# Altium project SCH-29227.PrjPcb (part 2 of 2)

## Sheet 01.SchDoc
size 386 x 246 mm
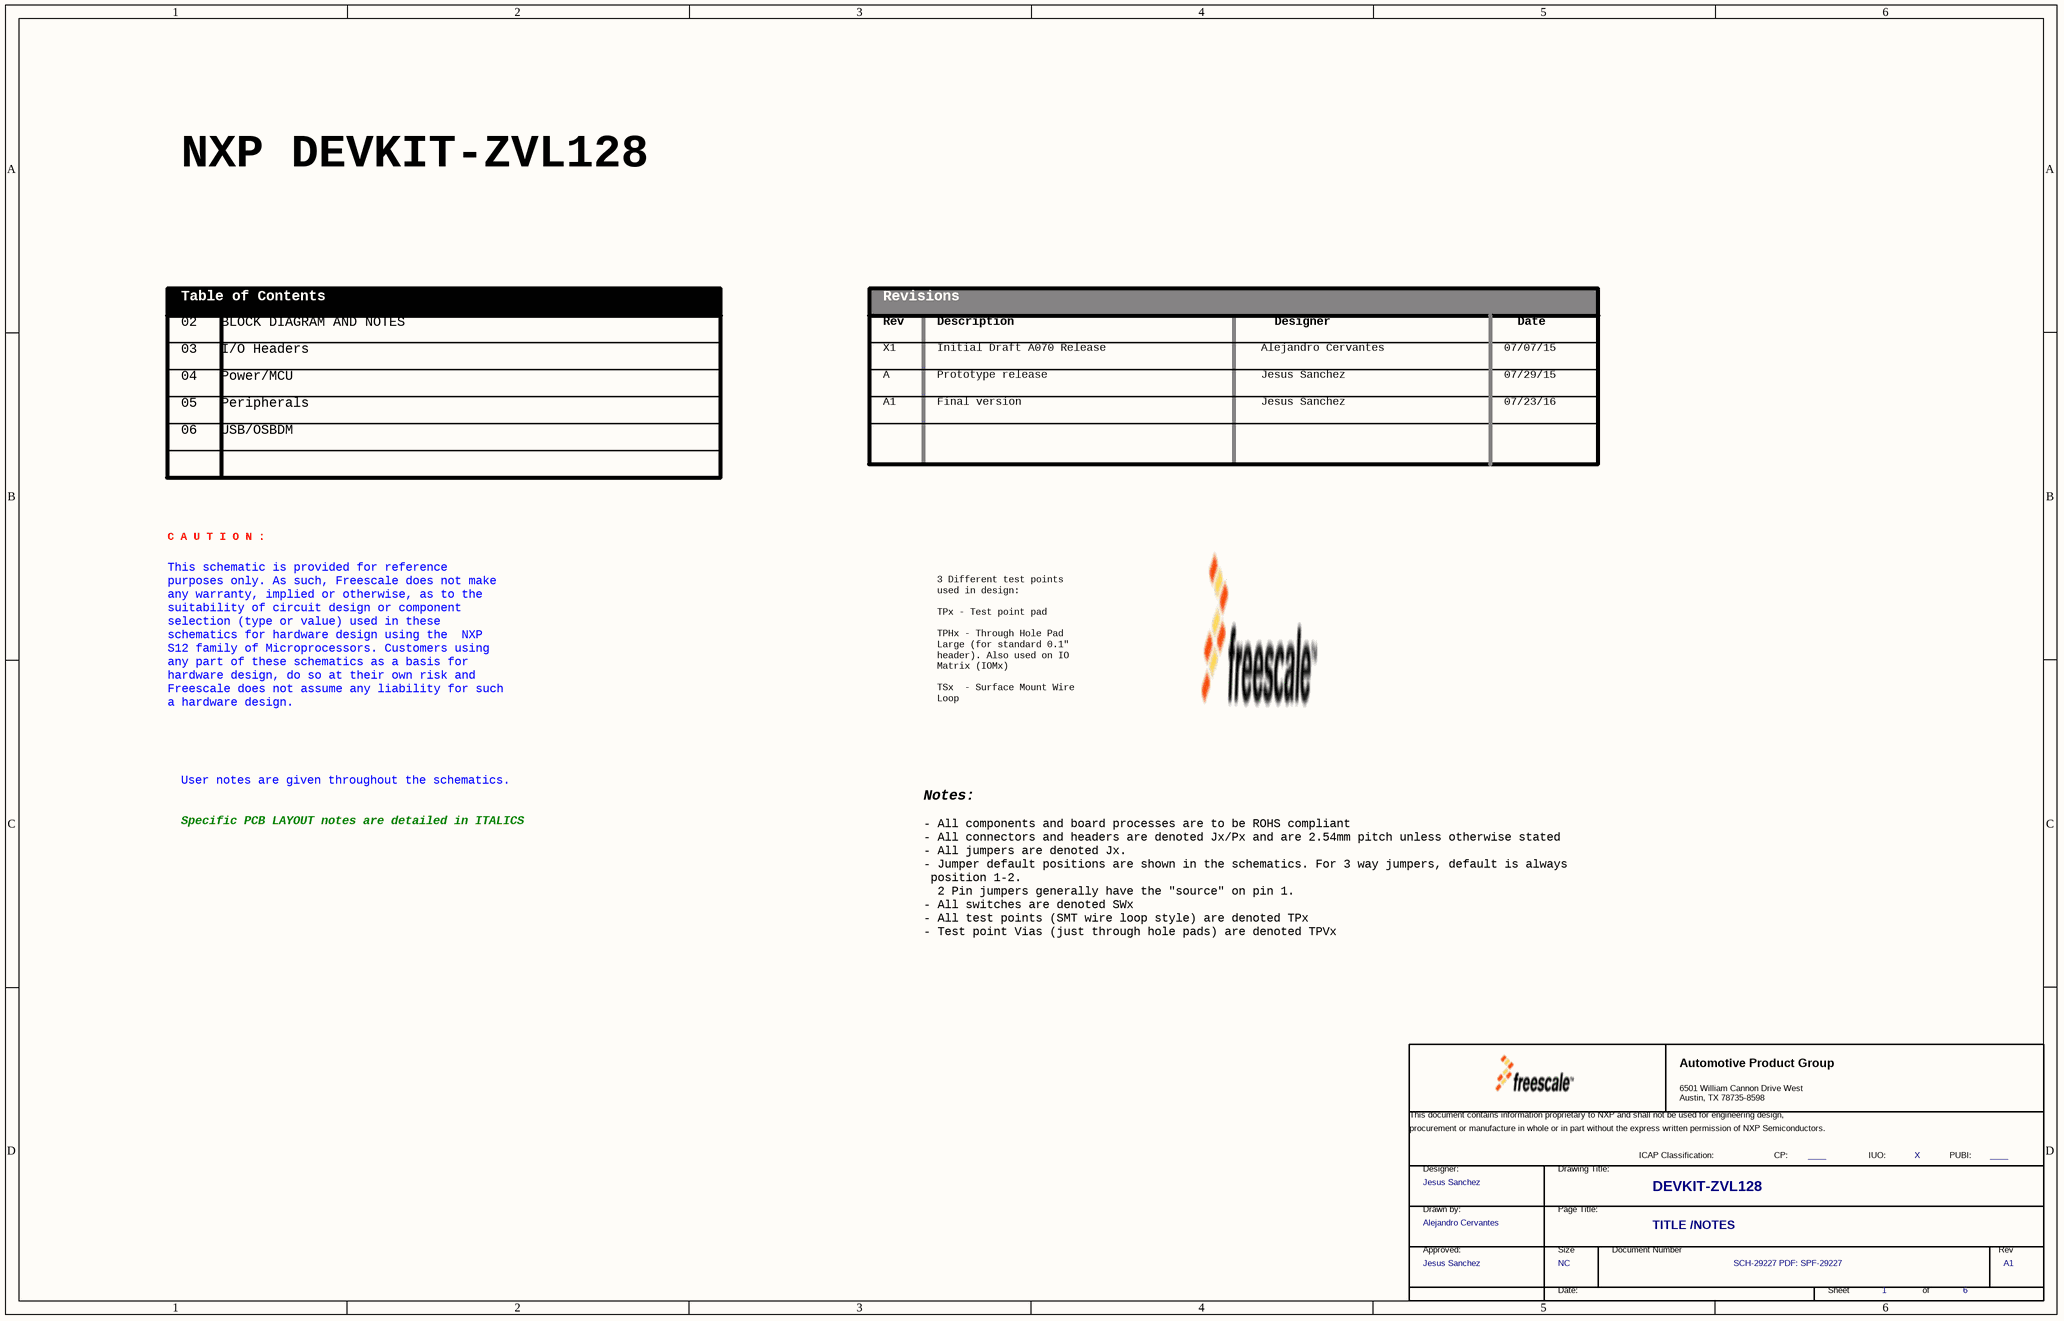
[diagram p9: 01.SchDoc]

### Parts
(Parts that share a designator on the sheet are numbered #1, #2 ... from top to bottom, then left to right.)
*#6  FCP: ____  FIUO: X  DrawnBy: Alejandro Cervantes  Approver: Jesus Sanchez  PageTitle: TITLE /NOTES  Page Count: 6  Page Number: 1  Page Size: NC  Title: DEVKIT-ZVL128  RevCode: A1  Doc: SCH-29227 PDF: SPF-29227  (hidden comment: TitleBlock_AMPG)  (graphical)

### Notes on the sheet
- NXP DEVKIT-ZVL128
- Table of Contents
- 02   BLOCK DIAGRAM AND NOTES
- Revisions
- Rev
- Description
- Designer
- Date
- 03   I/O Headers
- 04   Power/MCU
- X1
- A
- Initial Draft A070 Release
- Prototype release
- Alejandro Cervantes
- Jesus Sanchez
- 07/07/15
- 07/29/15
- 06   USB/OSBDM
- 05   Peripherals
- A1
- Final version
- 07/23/16
- This schematic is provided for reference
  purposes only. As such, Freescale does not make
  any warranty, implied or otherwise, as to the
  suitability of circuit design or component
  selection (type or value) used in these
  schematics for hardware design using the  NXP
  S12 family of Microprocessors. Customers using
  any part of these schematics as a basis for
  hardware design, do so at their own risk and
  Freescale does not assume any liability for such
  a hardware design.
- C A U T I O N :
- 3 Different test points
  used in design:
  TPx - Test point pad
  TPHx - Through Hole Pad
  Large (for standard 0.1"
  header). Also used on IO
  Matrix (IOMx)
  TSx  - Surface Mount Wire
  Loop
- User notes are given throughout the schematics.
- Notes:
- Specific PCB LAYOUT notes are detailed in ITALICS
- - All components and board processes are to be ROHS compliant
  - All connectors and headers are denoted Jx/Px and are 2.54mm pitch unless otherwise stated
  - All jumpers are denoted Jx.
  - Jumper default positions are shown in the schematics. For 3 way jumpers, default is always
  position 1-2.
  2 Pin jumpers generally have the "source" on pin 1.
  - All switches are denoted SWx
  - All test points (SMT wire loop style) are denoted TPx
  - Test point Vias (just through hole pads) are denoted TPVx
- (in symbol TitleBlock_AMPG) Automotive Product Group; 6501 William Cannon Drive West / Austin, TX 78735-8598; This document contains information proprietary to NXP and shall not be used for engineering design,; procurement or manufacture in whole or in part without the express written permission of NXP Semiconductors.; ICAP Classification:; CP:; IUO:; PUBI:; Designer:; Drawing Title:; Drawn by:; Page Title:; Approved:; Size; Document Number; Rev; Date:; Sheet; of

### Library data of the parts
*#6 = TitleBlock_AMPG: OrgName: Freescale Semiconductor; OrgAddr1: 6501 William Cannon Drive West; OrgAddr2: Austin, TX 78735-8598; PUBI: ____; Designer: Jesus Sanchez; Page Create Date: March  8, 1995

## Nets that join several sheets
GND: 06 (43 pins), 05 (7 pins), 04 (62 pins), 03 (9 pins)
P3V3: 04 (J11.2 R53.2 TP24.1), 03 (C75.1 J3.4)
P5V0: 04 (5 pins), 03 (C76.1 J3.5)
P5V_SWUSB: 06 (5 pins), 04 (J13.3)
VBAT: 04 (9 pins), 03 (C72.1 C73.1 J3.1 J3.8)
VDDX: 06 (7 pins), 05 (8 pins), 04 (21 pins), 03 (6 pins)
AN0: 04 (U11.16), 03 (J4.15 R73.1)
AN1: 04 (U11.13), 03 (J4.13)
AN2: 05 (J16.1), 04 (U11.12), 03 (R46.1)
AN3: 04 (U11.11), 03 (R47.1)
AN4: 04 (U11.10), 03 (J4.7)
AN5: 04 (U11.9), 03 (J4.5)
AN6: 04 (U11.8), 03 (J4.3)
AN7: 04 (U11.7), 03 (J4.1)
AN8: 04 (U11.6), 03 (J4.14)
AN9: 04 (U11.5), 03 (J4.16)
BKGD: 06 (U3.4), 04 (J8.1 TP5.1 U11.26)
PJ0: 04 (R59.1 U11.41), 03 (J2.9 R4.2)
PJ1: 04 (R60.1 U11.42), 03 (J2.10 R3.2)
PL0: 04 (U11.2), 03 (R68.1 TP45.1)
PP0: 04 (U11.30), 03 (J1.5)
PP1: 05 (SH6.2), 04 (U11.47), 03 (J1.7)
PP2: 04 (U11.31), 03 (J1.9)
PP3: 05 (SH8.2), 04 (U11.37), 03 (J1.11)
PP4: 05 (5 pins), 04 (U11.32), 03 (J1.13)
PP5: 05 (SH7.2), 04 (U11.39), 03 (J1.15)
PP6: 04 (U11.18), 03 (R2.1)
PP7: 05 (5 pins), 04 (U11.44), 03 (J2.2)
PS0: 04 (U11.28), 03 (J2.5)
PS1: 04 (U11.33), 03 (J2.4)
PS2: 04 (U11.34), 03 (J2.6)
PS3: 04 (U11.35), 03 (R1.1)
PT0: 04 (U11.22), 03 (R48.1)
PT1: 04 (U11.27), 03 (R49.1)
PT2: 04 (U11.40), 03 (J1.2)
PT3: 04 (U11.43), 03 (J1.4)
PT4: 06 (SH2.2), 04 (U11.19), 03 (J1.1)
PT5: 06 (SH1.2), 04 (U11.20), 03 (J1.3)
PT6: 04 (U11.17), 03 (J1.6)
PT7: 04 (U11.29), 03 (J2.1)
RESET_B: 06 (R23.2 U5.1), 04 (8 pins), 03 (J3.3)